# Altium schematic sheet Sata_Drives2.SchDoc
size 309 x 209 mm
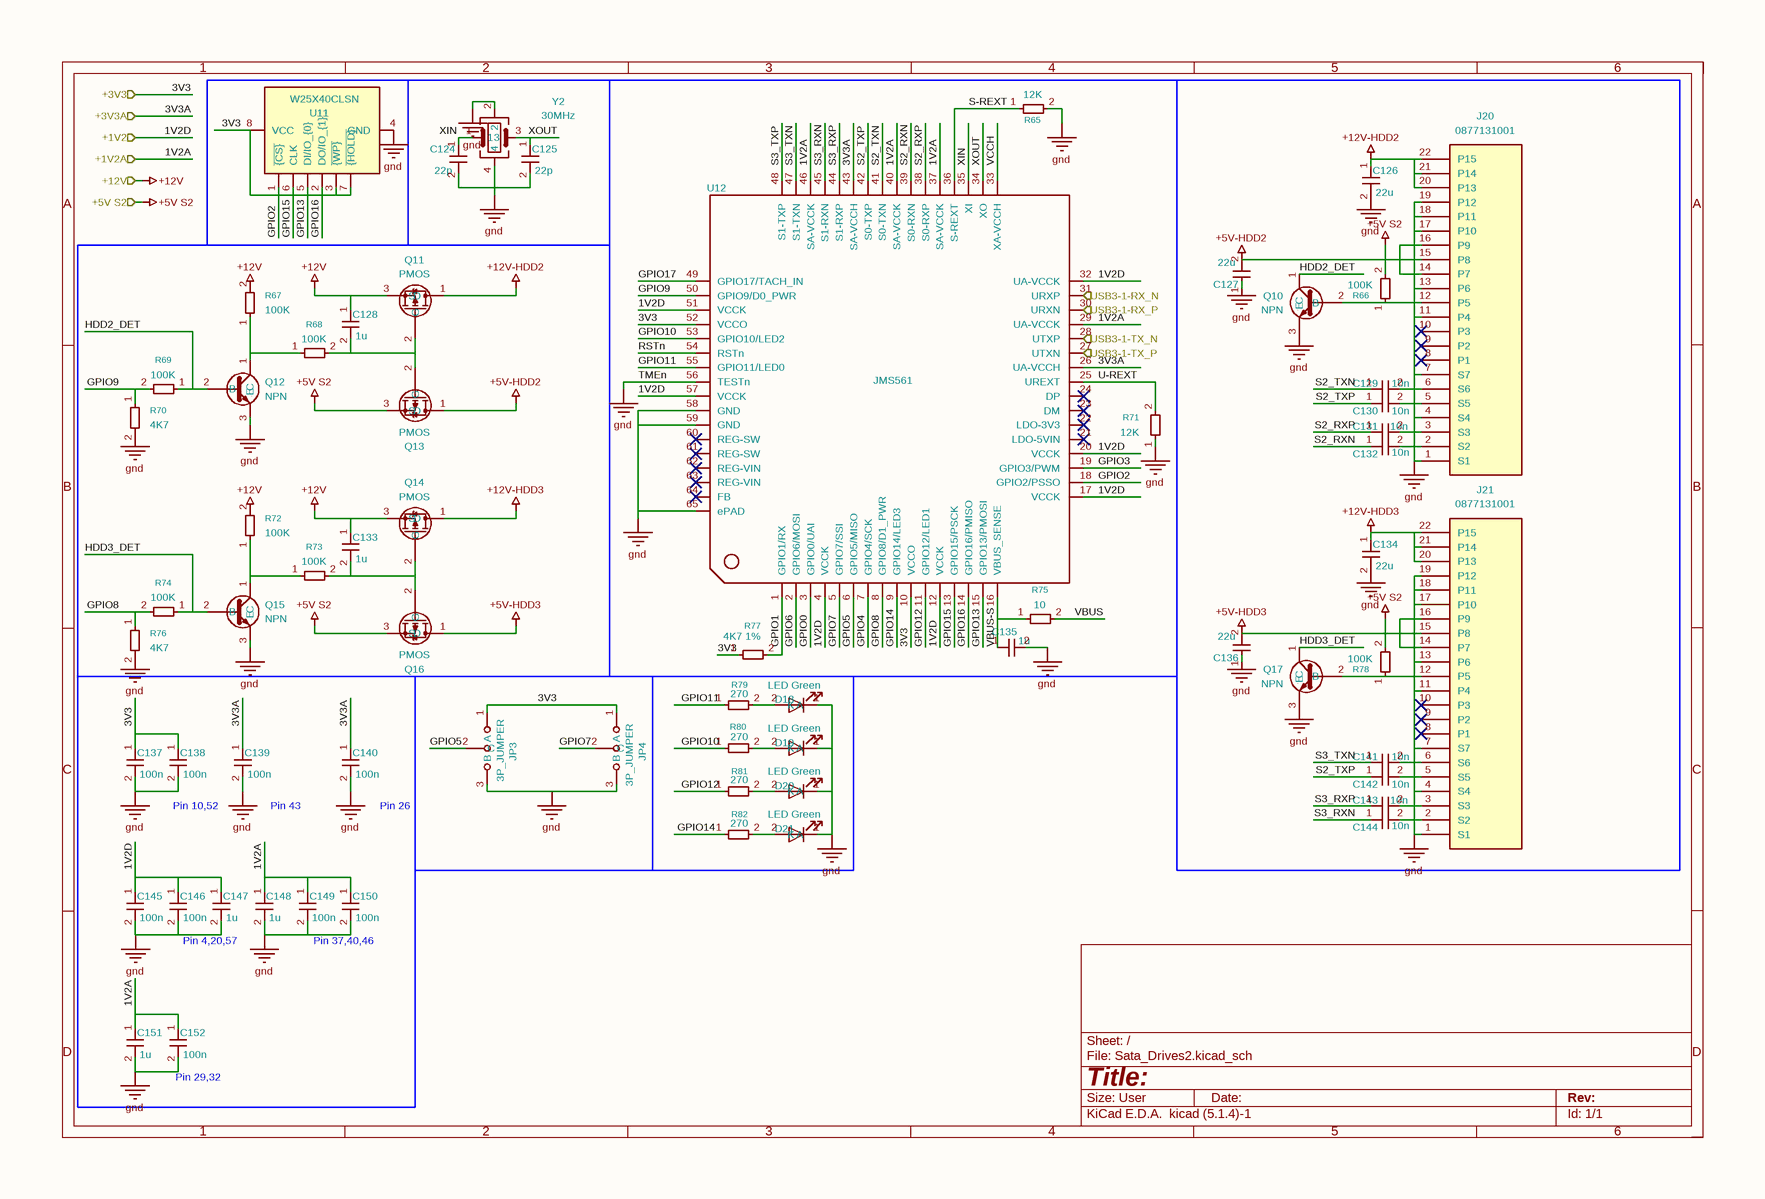
[diagram p0: Sata_Drives2.SchDoc]

## Parts
C124  22p  [C_0402_1005Metric]
C125  22p  [C_0402_1005Metric]
C126  22u  [C_1206_3216Metric]
C127  22u  [C_1206_3216Metric]
C128  1u  [C_0805_2012Metric]
C129  10n  [C_0402_1005Metric]
C130  10n  [C_0402_1005Metric]
C131  10n  [C_0402_1005Metric]
C132  10n  [C_0402_1005Metric]
C133  1u  [C_0805_2012Metric]
C134  22u  [C_1206_3216Metric]
C135  1u  [C_0603_1608Metric]
C136  22u  [C_1206_3216Metric]
C137  100n  [C_0603_1608Metric]
C138  100n  [C_0603_1608Metric]
C139  100n  [C_0603_1608Metric]
C140  100n  [C_0603_1608Metric]
C141  10n  [C_0402_1005Metric]
C142  10n  [C_0402_1005Metric]
C143  10n  [C_0402_1005Metric]
C144  10n  [C_0402_1005Metric]
C145  100n  [C_0603_1608Metric]
C146  100n  [C_0603_1608Metric]
C147  1u  [C_0805_2012Metric]
C148  1u  [C_0805_2012Metric]
C149  100n  [C_0603_1608Metric]
C150  100n  [C_0603_1608Metric]
C151  1u  [C_0805_2012Metric]
C152  100n  [C_0603_1608Metric]
D18  LED Green  [LED_0603_1608Metric]
D19  LED Green  [LED_0603_1608Metric]
D20  LED Green  [LED_0603_1608Metric]
D21  LED Green  [LED_0603_1608Metric]
J20  0877131001  [87713-1001]
J21  0877131001  [87713-1001]
JP3  3P_JUMPER  [PinHeader_1x03_P2.54mm_Vertical]
JP4  3P_JUMPER  [PinHeader_1x03_P2.54mm_Vertical]
Q10  NPN  [P200_SOT-23]
Q11  PMOS  [SOT95P237X117-3N]
Q12  NPN  [P200_SOT-23]
Q13  PMOS  [SOT95P237X117-3N]
Q14  PMOS  [SOT95P237X117-3N]
Q15  NPN  [P200_SOT-23]
Q16  PMOS  [SOT95P237X117-3N]
Q17  NPN  [P200_SOT-23]
R65  12K  [R_0603_1608Metric]
R66  100K  [R_0603_1608Metric]
R67  100K  [R_0603_1608Metric]
R68  100K  [R_0603_1608Metric]
R69  100K  [R_0603_1608Metric]
R70  4K7  [R_0603_1608Metric]
R71  12K  [R_0603_1608Metric]
R72  100K  [R_0603_1608Metric]
R73  100K  [R_0603_1608Metric]
R74  100K  [R_0603_1608Metric]
R75  10  [R_0603_1608Metric]
R76  4K7  [R_0603_1608Metric]
R77  4K7 1%  [R_0603_1608Metric]
R78  100K  [R_0603_1608Metric]
R79  270  [R_0603_1608Metric]
R80  270  [R_0603_1608Metric]
R81  270  [R_0603_1608Metric]
R82  270  [R_0603_1608Metric]
U11  W25X40CLSN  [SOIC-8_3.9x4.9mm_P1.27mm]
U12  JMS561  [QFN-64-1EP_8x8mm_P0.4mm_EP6.5x6.5mm_ThermalVias]
Y2  30MHz  [ABM810000MHZ12D2W]

## Ports
+1V2 (in), +1V2A (in), +3V3 (in), +3V3A (in), +5V S2 (in), +12V (in), USB3-1-RX_N (in), USB3-1-RX_P (in), USB3-1-TX_N (out), USB3-1-TX_P (out)

## Nets
+5V S2: Q13.3(S) Q16.3(S) R66.2 R78.2 ; port +5V S2
+5V-HDD2: C127.2 J20.14(P7) J20.15(P8) J20.16(P9) Q13.1(D)
+5V-HDD3: C136.2 J21.14(P7) J21.15(P8) J21.16(P9) Q16.1(D)
+12V: C128.1 C133.1 Q11.3(S) Q14.3(S) R67.2 R72.2 ; port +12V
+12V-HDD2: C126.1 J20.20(P13) J20.21(P14) J20.22(P15) Q11.1(D)
+12V-HDD3: C134.1 J21.20(P13) J21.21(P14) J21.22(P15) Q14.1(D)
TMEn: C124.2 C125.2 C126.2 C127.1 C134.2 C135.2 C136.1 C137.2 C138.2 C139.2 C140.2 C145.2 C146.2 C147.2 C148.2 C149.2 C150.2 C151.2 C152.2 D18.1(K) D19.1(K) D20.1(K) D21.1(K) J20.1(S1) J20.4(S4) J20.7(S7) J20.11(P4) J20.13(P6) J20.17(P10) J20.18(P11) J20.19(P12) J21.1(S1) J21.4(S4) J21.7(S7) J21.11(P4) J21.13(P6) J21.17(P10) J21.18(P11) J21.19(P12) JP3.3(B) JP4.3(B) Q10.3(E) Q12.3(E) Q15.3(E) Q17.3(E) R65.2 R70.2 R71.1 R76.2 U11.4(GND) U12.56(TESTn) U12.58(GND) U12.59(GND) U12.65(ePAD) Y2.2 Y2.4  [also labelled gnd]
1V2A: C148.1 C149.1 C150.1 C151.1 C152.1 U12.29(UA-VCCK) U12.37(SA-VCCK) U12.40(SA-VCCK) U12.46(SA-VCCK) ; port +1V2A
1V2D: C145.1 C146.1 C147.1 U12.4(VCCK) U12.12(VCCK) U12.17(VCCK) U12.20(VCCK) U12.32(UA-VCCK) U12.51(VCCK) U12.57(VCCK) ; port +1V2
3V3: C137.1 C138.1 JP3.1(A) JP4.1(A) R77.1 U11.3(~{{WP}}) U11.7(~{{HOLD}}) U11.8(VCC) U12.10(VCCO) U12.52(VCCO) ; port +3V3
3V3A: C139.1 C140.1 U12.26(UA-VCCH) U12.43(SA-VCCH) ; port +3V3A
GPIO0: U12.3(GPIO0/UAI)
GPIO1: R77.2 U12.1(GPIO1/RX)
GPIO2: U11.1(~{{CS}}) U12.18(GPIO2/PSSO)
GPIO3: U12.19(GPIO3/PWM)
GPIO4: U12.7(GPIO4/SCK)
GPIO5: JP3.2(C) U12.6(GPIO5/MISO)
GPIO6: U12.2(GPIO6/MOSI)
GPIO7: JP4.2(C) U12.5(GPIO7/SSI)
GPIO8: R74.2 R76.1 U12.8(GPIO8/D1_PWR)
GPIO9: R69.2 R70.1 U12.50(GPIO9/D0_PWR)
GPIO10: R80.1 U12.53(GPIO10/LED2)
GPIO11: R79.1 U12.55(GPIO11/LED0)
GPIO12: R81.1 U12.11(GPIO12/LED1)
GPIO13: U11.5(DI/IO_{0}) U12.15(GPIO13/PMOSI)
GPIO14: R82.1 U12.9(GPIO14/LED3)
GPIO15: U11.6(CLK) U12.13(GPIO15/PSCK)
GPIO16: U11.2(DO/IO_{1}) U12.14(GPIO16/PMISO)
GPIO17: U12.49(GPIO17/TACH_IN)
HDD2_DET: Q10.1(C) Q12.2(B) R69.1
HDD3_DET: Q15.2(B) Q17.1(C) R74.1
RSTn: U12.54(RSTn)
S2_RXN: C132.1 U12.39(S0-RXN)
S2_RXP: C131.1 U12.38(S0-RXP)
S2_TXN: C129.1 U12.41(S0-TXN)
S2_TXP: C130.1 C142.1 U12.42(S0-TXP)
S3_RXN: C144.1 U12.45(S1-RXN)
S3_RXP: C143.1 U12.44(S1-RXP)
S3_TXN: C141.1 U12.47(S1-TXN)
S3_TXP: U12.48(S1-TXP)
S-REXT: R65.1 U12.36(S-REXT)
U-REXT: R71.2 U12.25(UREXT)
USB3-1-RX_N: U12.31(URXP) ; port USB3-1-RX_N
USB3-1-RX_P: U12.30(URXN) ; port USB3-1-RX_P
USB3-1-TX_N: U12.28(UTXP) ; port USB3-1-TX_N
USB3-1-TX_P: U12.27(UTXN) ; port USB3-1-TX_P
VBUS: R75.2
VBUS-S: C135.1 R75.1 U12.16(VBUS_SENSE)
VCCH: U12.33(XA-VCCH)
XIN: C124.1 U12.35(XI) Y2.1
XOUT: C125.1 U12.34(XO) Y2.3
NetC128_2: C128.2 Q11.2(G) Q13.2(G) R68.2
NetC129_2: C129.2 J20.6(S6)
NetC130_2: C130.2 J20.5(S5)
NetC131_2: C131.2 J20.3(S3)
NetC132_2: C132.2 J20.2(S2)
NetC133_2: C133.2 Q14.2(G) Q16.2(G) R73.2
NetC141_2: C141.2 J21.6(S6)
NetC142_2: C142.2 J21.5(S5)
NetC143_2: C143.2 J21.3(S3)
NetC144_2: C144.2 J21.2(S2)
NetD18_2: D18.2(A) R79.2
NetD19_2: D19.2(A) R80.2
NetD20_2: D20.2(A) R81.2
NetD21_2: D21.2(A) R82.2
NetJ20_12: J20.12(P5) Q10.2(B) R66.1
NetJ21_12: J21.12(P5) Q17.2(B) R78.1
NetQ12_1: Q12.1(C) R67.1 R68.1
NetQ15_1: Q15.1(C) R72.1 R73.1

Not connected (* = marked no-connect by the designer): J20 8(P1)* 9(P2)* 10(P3)*; J21 8(P1)* 9(P2)* 10(P3)*; U12 21(LDO-5VIN)* 22(LDO-3V3)* 23(DM)* 24(DP)* 60(REG-SW)* 61(REG-SW)* 62(REG-VIN)* 63(REG-VIN)* 64(FB)*

## Notes on the sheet
- Pin 10,52
- Pin 43
- Pin 26
- Pin 4,20,57
- Pin 37,40,46
- (near C152) Pin 29,32
- 1
- 2
- 3
- 4
- 5
- 6
- A
- B
- C
- D
- Title:
- File: Sata_Drives2.kicad_sch
- Sheet: /
- KiCad E.D.A.  kicad (5.1.4)-1
- Size: User
- Date:
- Rev:
- Id: 1/1

## Library data of the parts
C124-C152 = C_Small: Description: Unpolarized capacitor, small symbol
  C124 C125: Value: 22p; Footprint: Capacitor_SMD:C_0402_1005Metric
  C126 C127 C134 C136: Value: 22u; Footprint: Capacitor_SMD:C_1206_3216Metric
  C128 C133 C147 C148 C151: Value: 1u; Footprint: Capacitor_SMD:C_0805_2012Metric
  C129-C132 C141-C144: Value: 10n; Footprint: Capacitor_SMD:C_0402_1005Metric
  C135: Value: 1u; Footprint: Capacitor_SMD:C_0603_1608Metric
  C137-C140 C145 C146 C149 C150 C152: Value: 100n; Footprint: Capacitor_SMD:C_0603_1608Metric
D18-D21 = LED: Part Description: Green 572nm LED Indication - Discrete 2.2V 2-SMD, No Lead; Field4: Digikey; Field5: LTST-S270KGKT; Field6: SML-A12M8TT86N; Field7: Rohm; Field8: 650263301; Value: LED Green; Footprint: LED_SMD:LED_0603_1608Metric
J20 J21 = 0877131001: Manufacturer_Name: Molex; Description: CONN RCPT 22POS STR .05" SMD AU; Manufacturer_Part_Number: 0877131001; Mouser Part Number: N/A; Mouser Price/Stock: https://www.mouser.co.uk/ProductDetail/Molex/0877131001?qs=PBcRNPEHKspplW%252BmhlTGqA%3D%3D; Arrow Part Number: 0877131001; Arrow Price/Stock: https://www.arrow.com/en/products/0877131001/molex?region=nac; Value: 0877131001; Footprint: 87713-1001:87713-1001
JP3 JP4 = Jumper_3_Bridged12: Description: Jumper, 3-pole, pins 1+2 closed/bridged; Value: 3P_JUMPER; Footprint: Connector_PinHeader_2.54mm:PinHeader_1x03_P2.54mm_Vertical
Q10 Q12 Q15 Q17 = NPN: Description: Bipolar transistor symbol for simulation only, substrate tied to the emitter; Sim.Type: GUMMELPOON; Sim.Pins: 1=C 2=B 3=E; Sim.Device: NPN; Value: NPN; Footprint: MMBT3904:P200_SOT-23
Q11 Q13 Q14 Q16 = PMOS: Description: P-MOSFET transistor, drain/source/gate; Sim.Type: VDMOS; Sim.Pins: 1=D 2=G 3=S; Sim.Device: PMOS; Value: PMOS; Footprint: AOSS21311C:SOT95P237X117-3N
R65-R82 = R_Small: Description: Resistor, small symbol; Footprint: Resistor_SMD:R_0603_1608Metric
  R65 R71: Value: 12K
  R66-R69 R72-R74 R78: Value: 100K
  R70 R76: Value: 4K7
  R75: Value: 10
  R77: Value: 4K7 1%
  R79-R82: Value: 270
U11 = W25X40CLSN: Description: 4Mbit / 512KiB Serial Flash memory, Standard/Dual I/O SPI, 2.3-3.6V, SOIC-8 (150 mil); Value: W25X40CLSN; Footprint: Package_SO:SOIC-8_3.9x4.9mm_P1.27mm
U12 = JMS561: Description: JMS561 is a SuperSpeed USB 5Gb/s to dual SATA 6Gb/s bridge controller, which also supports various application configurations.; Value: JMS561; Footprint: Package_DFN_QFN:QFN-64-1EP_8x8mm_P0.4mm_EP6.5x6.5mm_ThermalVias
Y2 = Crystal_GND24: Description: Four pin crystal, GND on pins 2 and 4; Value: 30MHz; Footprint: ABM8-30.000MHZ-B2-T:ABM810000MHZ12D2W